# EAGLE design Bluetooth (EAGLE 6.4)
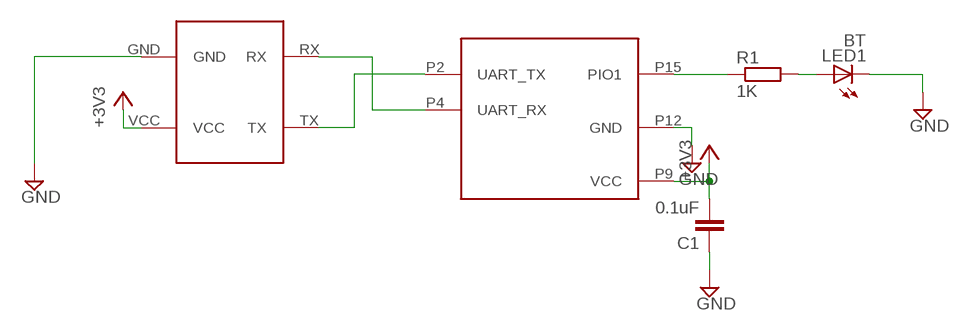
[diagram p0: schematic, sheet 1]

## Parts
C1  0.1uF  C-EUC0805  [C0805]
LED1  BT  LEDCHIPLED_0805  [CHIPLED_0805]
R1  1K  R-EU_R0805  [R0805]
U$1  BLUESIMPLE  [BLUESIMPLE]
U$2  BLUE-BOARD  [BLUE-BOARD]

## Nets
+3V3: C1.2 U$1.P9(VCC) U$2.VCC
GND: C1.1 LED1.C U$1.P12(GND) U$2.GND
N$1: U$1.P4(UART_RX) U$2.RX
N$2: U$1.P2(UART_TX) U$2.TX
N$13: R1.1 U$1.P15(PIO1)
N$15: LED1.A R1.2

## Library data of the parts
C1 = resistor:C-EU: CAPACITOR, European symbol
LED1 = led:LED: LED OSRAM: - CHIPLED LG R971, LG N971, LY N971, LG Q971, LY Q971, LO R971, LY R971 LH N974, LH R974 LS Q976, LO Q976, LY Q976 LO Q996 - Hyper CHIPLED LW Q18S LB Q993, LB Q99A, LB R99A - SideLED LS A670, LO A670, LY A670, LG A670, LP A670 LB A673, LV A673, LT A673, LW A673 LH A674 LY A675 LS A676, LA A676, LO A676, LY A676, LW A676 LS A679, LY A679, LG A679 - Hyper Micro SIDELED® LS Y876, LA Y876, LO Y876, LY Y876 LT Y87S - SmartLED LW L88C, LW L88S LB L89C, LB L89S, LG L890 LS L89K, LO L89K, LY L89K LS L896, LA L896, LO L896, LY L896 - TOPLED LS T670, LO T670, LY T670, LG T670, LP T670 LSG T670, LSP T670, LSY T670, LOP T670, LYG T670 LG T671, LOG T671, LSG T671 LB T673, LV T673, LT T673, LW T673 LH T674 LS T676, LA T676, LO T676, LY T676, LB T676, LH T676, LSB T676, LW T676 LB T67C, LV T67C, LT T67C, LS T67K, LO T67K, LY T67K, LW E67C LS E67B, LA E67B, LO E67B, LY E67B, LB E67C, LV E67C, LT E67C LW T67C LS T679, LY T679, LG T679 LS T770, LO T770, LY T770, LG T770, LP T770 LB T773, LV T773, LT T773, LW T773 LH T774 LS E675, LA E675, LY E675, LS T675 LS T776, LA T776, LO T776, LY T776, LB T776 LHGB T686 LT T68C, LB T68C - Hyper Mini TOPLED® LB M676 - Mini TOPLED Santana® LG M470 LS M47K, LO M47K, LY M47K Source: http://www.osram.convergy.de LUXEON: - LUMILED® LXK2-PW12-R00, LXK2-PW12-S00, LXK2-PW14-U00, LXK2-PW14-V00 LXK2-PM12-R00, LXK2-PM12-S00, LXK2-PM14-U00 LXK2-PE12-Q00, LXK2-PE12-R00, LXK2-PE12-S00, LXK2-PE14-T00, LXK2-PE14-U00 LXK2-PB12-K00, LXK2-PB12-L00, LXK2-PB12-M00, LXK2-PB14-N00, LXK2-PB14-P00, LXK2-PB14-Q00 LXK2-PR12-L00, LXK2-PR12-M00, LXK2-PR14-Q00, LXK2-PR14-R00 LXK2-PD12-Q00, LXK2-PD12-R00, LXK2-PD12-S00 LXK2-PH12-R00, LXK2-PH12-S00 LXK2-PL12-P00, LXK2-PL12-Q00, LXK2-PL12-R00 Source: www.luxeon.com KINGBRIGHT: KA-3528ASYC Source: www.kingbright.com
R1 = resistor:R-EU_: RESISTOR, European symbol
U$1 = Mini-Q:BLUESIMPLE
U$2 = Mini-Q:BLUE-BOARD

## Board
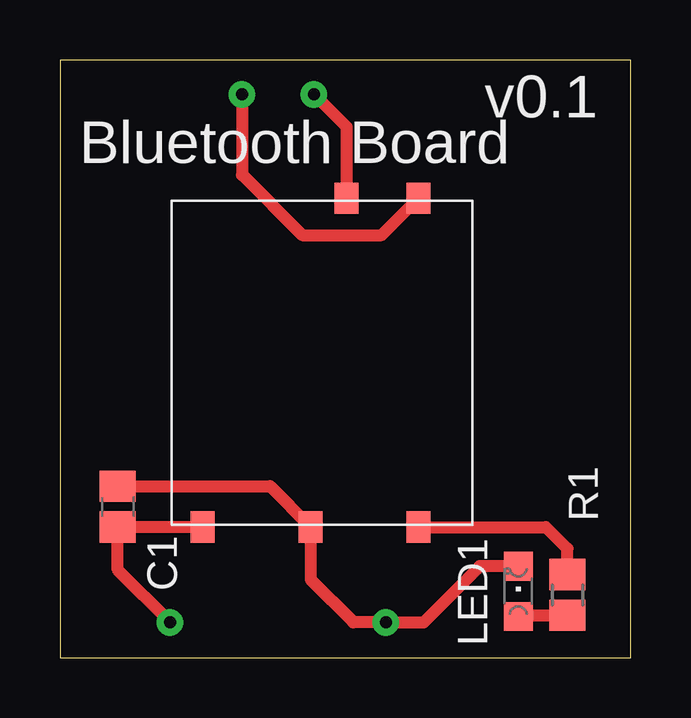
[diagram p1: board, top side]

Size 23.8 x 24.9 mm. Coordinates in mm from the lower left corner, seen from the top.
Outline: 0,0 23.8,0 23.8,24.9 0,24.9 0,0
Copper layers (1*16): Top 0.035mm / dielectric 1.5mm / Bottom 0.035mm
Design rules "SparkFun-2-layer": minimum track width 7mil, minimum drill 15mil, track to track 8mil, track to pad 8mil, pad to pad 8mil, via to via 8mil, smd to smd 8mil, copper to edge 8mil, drill to drill 8mil, minimum pad ring 12mil, minimum via ring 10mil, stop-mask expansion 4mil, vias tented up to drill 20mil, thermal gap 10mil

### Footprints (pad centres in the part's own frame; a part is rotated, then mirrored left to right if it is on the bottom)
C0805 = smd 1.3 x 1.5: 1 -0.85,0; 2 0.85,0
CHIPLED_0805 = smd 1.2 x 1.2: A 0,-1.05; C 0,1.05
R0805 = smd 1.3 x 1.5: 1 -0.85,0; 2 0.85,0
BLUESIMPLE = smd 1.3 x 1: P2 -0.1,-8.6; P4 -0.1,-11.6; P9 13.6,-17.6; P12 13.6,-13.1; P15 13.6,-8.6
BLUE-BOARD = drill 0.5: GND -11,-4.5; RX 11,-1.5; TX 11,1.5; VCC -11,4.5

### Placement (x,y rotation side)
C1  2.41,6.29 270 top
LED1  19.11,2.76 0 top
R1  21.16,2.61 270 top
U$1  23.55,19.04 270 top
U$2  9.09,12.47 90 top

### Tracks (layer width: path | path; a pad name or v marks a point on that pad's centre or on a via)
+3V3
  Top 0.5: U$1.P9 C1.2 2.41,3.65 U$2.VCC
GND
  Top 0.5: C1.1 8.75,7.14 U$1.P12 10.45,3.25 12.23,1.47 U$2.GND 15.17,1.47 17.51,3.81 LED1.C
N$1
  Top 0.5: U$2.RX 11.95,22.11 U$1.P4
N$2
  Top 0.5: U$2.TX 7.59,20.11 10.1,17.6 13.41,17.6 U$1.P2
N$13
  Top 0.5: U$1.P15 20.26,5.44 21.16,4.54 R1.1
N$15
  Top 0.5: LED1.A 19.16,1.76 R1.2

### Text on the board
tNames: v0.1 | Bluetooth Board